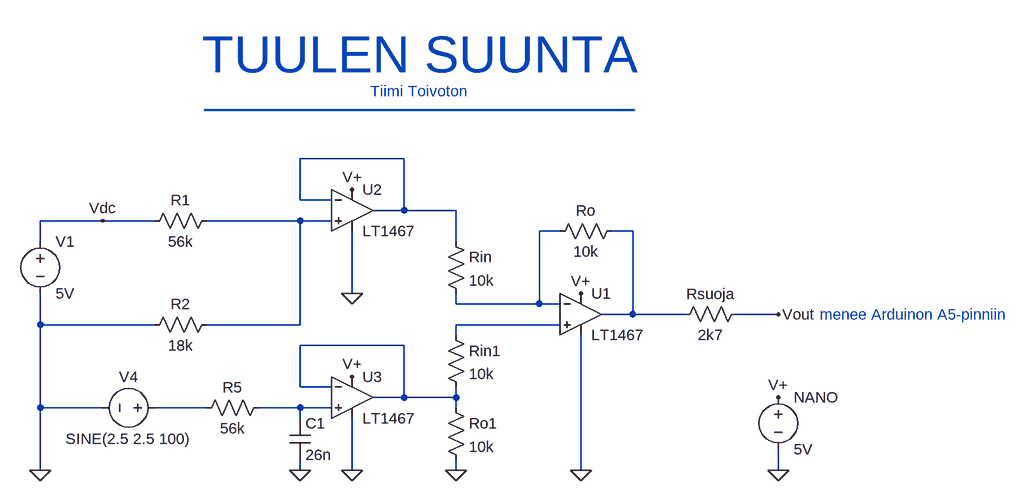
[diagram p0: schematic Tuulen suunta (Analoginen signaali).asc]
Tuulen suunta (Analoginen signaali).asc, the LTspice schematic file:
Version 4.1
SHEET 1 880 680
WIRE -288 32 -448 32
WIRE -448 96 -448 32
WIRE -400 96 -448 96
WIRE -288 112 -288 32
WIRE -288 112 -336 112
WIRE -208 112 -288 112
WIRE -752 128 -848 128
WIRE -672 128 -752 128
WIRE -448 128 -592 128
WIRE -400 128 -448 128
WIRE -48 144 -80 144
WIRE 64 144 32 144
WIRE -848 160 -848 128
WIRE -208 160 -208 112
WIRE -368 240 -368 144
WIRE -208 256 -208 240
WIRE -80 256 -80 144
WIRE -80 256 -208 256
WIRE -48 256 -80 256
WIRE 64 272 64 144
WIRE 64 272 16 272
WIRE 144 272 64 272
WIRE 288 272 224 272
WIRE -848 288 -848 240
WIRE -672 288 -848 288
WIRE -448 288 -448 128
WIRE -448 288 -592 288
WIRE -48 288 -208 288
WIRE -208 304 -208 288
WIRE -288 320 -448 320
WIRE -448 384 -448 320
WIRE -400 384 -448 384
WIRE -288 400 -288 320
WIRE -288 400 -336 400
WIRE -208 400 -208 384
WIRE -208 400 -288 400
WIRE -848 416 -848 288
WIRE -752 416 -848 416
WIRE -592 416 -672 416
WIRE -448 416 -512 416
WIRE -400 416 -448 416
WIRE -208 416 -208 400
WIRE -448 432 -448 416
WIRE -848 512 -848 416
WIRE -448 512 -448 496
WIRE -368 512 -368 432
WIRE -208 512 -208 496
WIRE -16 512 -16 304
WIRE 288 512 288 480
FLAG -208 512 0
FLAG -448 512 0
FLAG -368 512 0
FLAG -848 512 0
FLAG -368 240 0
FLAG -16 512 0
FLAG -16 240 V+
FLAG 288 400 V+
FLAG 288 512 0
FLAG 288 272 Vout
FLAG -368 80 V+
FLAG -368 368 V+
FLAG -752 128 Vdc
SYMBOL OpAmps\\LT1467 -16 208 R0
SYMATTR InstName U1
SYMBOL res -224 144 R0
SYMATTR InstName Rin
SYMATTR Value 10k
SYMBOL res -224 288 R0
SYMATTR InstName Rin1
SYMATTR Value 10k
SYMBOL res 240 256 R90
WINDOW 0 0 56 VBottom 2
WINDOW 3 32 56 VTop 2
SYMATTR InstName Rsuoja
SYMATTR Value 2k7
SYMBOL res -224 400 R0
SYMATTR InstName Ro1
SYMATTR Value 10k
SYMBOL OpAmps\\LT1467 -368 336 R0
SYMATTR InstName U3
SYMBOL cap -464 432 R0
SYMATTR InstName C1
SYMATTR Value 26n
SYMBOL res -496 400 R90
WINDOW 0 0 56 VBottom 2
WINDOW 3 32 56 VTop 2
SYMATTR InstName R5
SYMATTR Value 56k
SYMBOL voltage -656 416 R90
WINDOW 0 -32 56 VBottom 2
WINDOW 3 32 56 VTop 2
WINDOW 123 0 0 Left 0
WINDOW 39 0 0 Left 0
SYMATTR InstName V4
SYMATTR Value SINE(2.5 2.5 100)
SYMBOL voltage -848 144 R0
SYMATTR InstName V1
SYMATTR Value 5V
SYMBOL res -576 272 R90
WINDOW 0 0 56 VBottom 2
WINDOW 3 32 56 VTop 2
SYMATTR InstName R2
SYMATTR Value 18k
SYMBOL res -576 112 R90
WINDOW 0 0 56 VBottom 2
WINDOW 3 32 56 VTop 2
SYMATTR InstName R1
SYMATTR Value 56k
SYMBOL OpAmps\\LT1467 -368 48 R0
SYMATTR InstName U2
SYMBOL voltage 288 384 R0
SYMATTR InstName NANO
SYMATTR Value 5V
SYMBOL res 48 128 R90
WINDOW 0 0 56 VBottom 2
WINDOW 3 32 56 VTop 2
SYMATTR InstName Ro
SYMATTR Value 10k
TEXT -264 -128 Center 6 ;TUULEN SUUNTA
TEXT -264 -72 Center 2 ;Tiimi Toivoton
TEXT -264 -72 Center 5 ;_____________________
TEXT 352 272 Left 2 ;menee Arduinon A5-pinniin

The netlist it stands for:
* Tuulen suunta (Analoginen signaali).asc
X§U1 N005 N003 V+ 0 N004 LT1467  ; pins In+ In- V+ V- OUT
Rin N001 N003 10k
Rin1 N005 N006 10k
Rsuoja Vout N004 2k7
Ro1 N006 0 10k
X§U3 N008 N006 V+ 0 N006 LT1467  ; pins In+ In- V+ V- OUT
C1 N008 0 26n
R5 N008 N007 56k
V4 N007 0 SINE(2.5 2.5 100)
V1 Vdc 0 5V
R2 N002 0 18k
R1 N002 Vdc 56k
X§U2 N002 N001 V+ 0 N001 LT1467  ; pins In+ In- V+ V- OUT
V§NANO V+ 0 5V
Ro N004 N003 10k
* TUULEN SUUNTA
* Tiimi Toivoton
* _____________________
* menee Arduinon A5-pinniin
.backanno
.end